# EAGLE design movimiento (EAGLE 8.7.1)
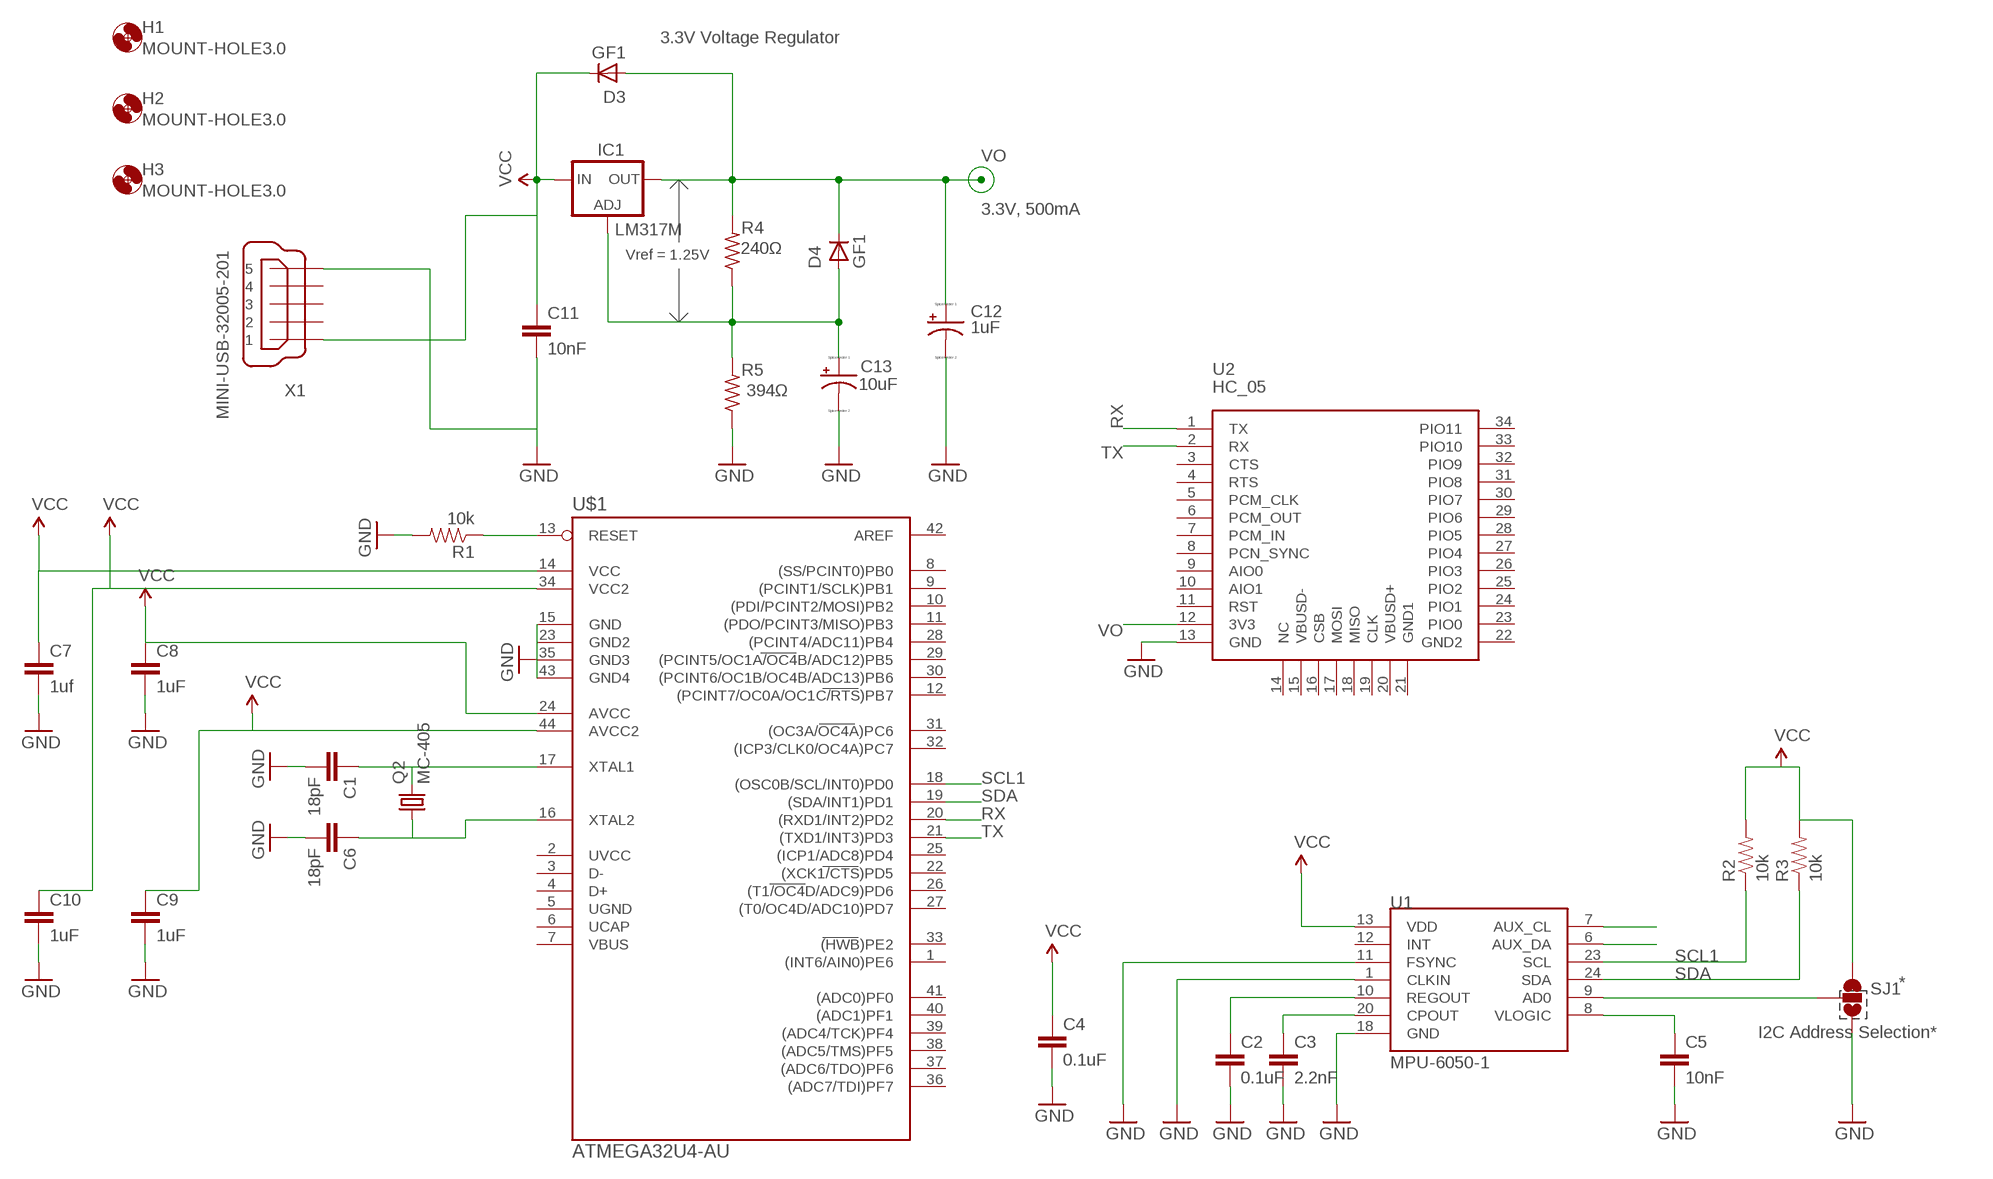
[diagram p0: schematic, sheet 1]

## Parts
C1  18pF  CAP0603-CAP  [0603-CAP]
C2  0.1uF  CAP0603-CAP  [0603-CAP]
C3  2.2nF  CAP0603-CAP  [0603-CAP]
C4  0.1uF  CAP0603-CAP  [0603-CAP]
C5  10nF  CAP0603-CAP  [0603-CAP]
C6  18pF  CAP0603-CAP  [0603-CAP]
C7  1uf  CAP0603-CAP  [0603-CAP]
C8  1uF  CAP0603-CAP  [0603-CAP]
C9  1uF  CAP0603-CAP  [0603-CAP]
C10  1uF  CAP0603-CAP  [0603-CAP]
C11  10nF  CAP0603-CAP  [0603-CAP]
C12  1uF  CPOL-US085CS-1AR  [085CS_1AR]
C13  10uF  CPOL-US085CS-1AR  [085CS_1AR]
D3  GF1  [SMA-DO214AC]
D4  GF1  [SMA-DO214AC]
H1  MOUNT-HOLE3.0  [3,0]
H2  MOUNT-HOLE3.0  [3,0]
H3  MOUNT-HOLE3.0  [3,0]
IC1  LM317MBSTT3  [SOT223]
Q2  MC-405  [MC-405]
R1  10k  RESISTOR0603-RES  [0603-RES]
R2  10k  RESISTOR0603-RES  [0603-RES]
R3  10k  RESISTOR0603-RES  [0603-RES]
R4  240Ω  R-US_M0805  [M0805]
R5  394Ω  R-US_M0805  [M0805]
SJ1  SOLDERJUMPER_2WAYPASTE2&3  [SJ_3_PASTE2&3]
U1  MPU-6050-1  [QFN-24-4MM2]
U2  HC_05  [BLUETOOTH_SMD]
U$1  ATMEGA32U4-AU  [TQFP44]
X1  MINI-USB-32005-201  [32005-201]

## Nets
ADO: SJ1.2 U1.9(AD0)
AUX_SCL: U1.7(AUX_CL)
AUX_SDA: U1.6(AUX_DA)
GND: C1.2 C2.2 C3.2 C4.2 C5.2 C6.2 C7.2 C8.2 C9.2 C10.2 C11.2 C12.- C13.- R1.2 R5.1 SJ1.3 U1.1(CLKIN) U1.11(FSYNC) U1.18(GND) U2.13(GND) X1.5
N$1: C1.1 Q2.2 U$1.17(XTAL1)
N$2: C6.1 Q2.1 U$1.16(XTAL2)
N$3: R1.1 U$1.13(RESET)
N$4: U$1.15(GND) U$1.23(GND2) U$1.35(GND3) U$1.43(GND4)
N$5: C3.1 U1.20(CPOUT)
N$6: C2.1 U1.10(REGOUT)
N$7: C13.+ D4.A IC1.1(ADJ) R4.1 R5.2
RX: U2.1(TX) U$1.20((RXD1/INT2)PD2)
SCL1: R2.1 U1.23(SCL) U$1.18((OSC0B/SCL/INT0)PD0)
SDA: R3.1 U1.24(SDA) U$1.19((SDA/INT1)PD1)
TX: U2.2(RX) U$1.21((TXD1/INT3)PD3)
VCC: C4.1 C7.1 C8.1 C9.1 C10.1 R2.2 R3.2 SJ1.1 U1.13(VDD) U$1.14(VCC) U$1.24(AVCC) U$1.34(VCC2) U$1.44(AVCC2)
VIN: C11.1 D3.K(C) IC1.3(IN) X1.1
VIO: C5.1 U1.8(VLOGIC)
VO: C12.+ D3.A D4.K(C) IC1.4(OUT) R4.2 U2.12(3V3)
Unconnected: U1.12(INT) U2.3(CTS) U2.4(RTS) U2.5(PCM_CLK) U2.6(PCM_OUT) U2.7(PCM_IN) U2.8(PCN_SYNC) U2.9(AIO0) U2.10(AIO1) U2.11(RST) U2.14(NC) U2.15(VBUSD-) U2.16(CSB) U2.17(MOSI) U2.18(MISO) U2.19(CLK) U2.20(VBUSD+) U2.21(GND1) U2.22(GND2) U2.23(PIO0) U2.24(PIO1) U2.25(PIO2) U2.26(PIO3) U2.27(PIO4) U2.28(PIO5) U2.29(PIO6) U2.30(PIO7) U2.31(PIO8) U2.32(PIO9) U2.33(PIO10) U2.34(PIO11) U$1.1((INT6/AIN0)PE6) U$1.2(UVCC) U$1.3(D-) U$1.4(D+) U$1.5(UGND) U$1.6(UCAP) U$1.7(VBUS) U$1.8((SS/PCINT0)PB0) U$1.9((PCINT1/SCLK)PB1) U$1.10((PDI/PCINT2/MOSI)PB2) U$1.11((PDO/PCINT3/MISO)PB3) U$1.12((PCINT7/OC0A/OC1C/RTS)PB7) U$1.22((XCK1/CTS)PD5) U$1.25((ICP1/ADC8)PD4) U$1.26((T1/OC4D/ADC9)PD6) U$1.27((T0/OC4D/ADC10)PD7) U$1.28((PCINT4/ADC11)PB4) U$1.29((PCINT5/OC1A/OC4B/ADC12)PB5) U$1.30((PCINT6/OC1B/OC4B/ADC13)PB6) U$1.31((OC3A/OC4A)PC6) U$1.32((ICP3/CLK0/OC4A)PC7) U$1.33((HWB)PE2) U$1.36((ADC7/TDI)PF7) U$1.37((ADC6/TDO)PF6) U$1.38((ADC5/TMS)PF5) U$1.39((ADC4/TCK)PF4) U$1.40((ADC1)PF1) U$1.41((ADC0)PF0) U$1.42(AREF) X1.2 X1.3 X1.4

## Notes on the sheet
- 3.3V Voltage Regulator
- 3.3V, 500mA
- Vref = 1.25V
- *
- I2C Address Selection*

## Library data of the parts
C1-C11 = SparkFun:CAP: Capacitor Standard 0603 ceramic capacitor, and 0.1" leaded capacitor.
C12 C13 = resistor:CPOL-US: POLARIZED CAPACITOR, American symbol
D3 D4 = diode:GF1: DIODE
H1-H3 = holes:MOUNT-HOLE: MOUNTING HOLE with drill center marker
IC1 = v-reg:LM317?*: 500 mA Adjustable Output Positive Voltage Regulator Source: http://www.onsemi.co.jp .. LM317M-D.PDF; PARTNUMBER: LM317M
Q2 = crystal:MC-405: kHz RANGE CRYSTAL UNIT SMD Source: MC-306_405_406_E07X.PDF Homepage <http://www.epsontoyocom.co.jp>; OC_FARNELL: unknown; OC_NEWARK: unknown
R1-R3 = SparkFun:RESISTOR: Resistor Basic schematic elements and footprints for 0603, 1206, and PTH resistors.
R4 R5 = resistor:R-US_: RESISTOR, American symbol
SJ1 = SparkFun:SOLDERJUMPER_2WAY: Solder Jumper 2 way solder jumper
U1 = Testing:MPU-6050
U2 = Modulo Bloutooth:HC_05: HC-05 Bluetooth Module
U$1 = mega32U4:ATMEGA32U4-AU
X1 = con-cypressindustries:MINI-USB-: MINI USB-B Conector Source: www.cypressindustries.com; OC_FARNELL: unknown; OC_NEWARK: unknown

## Board
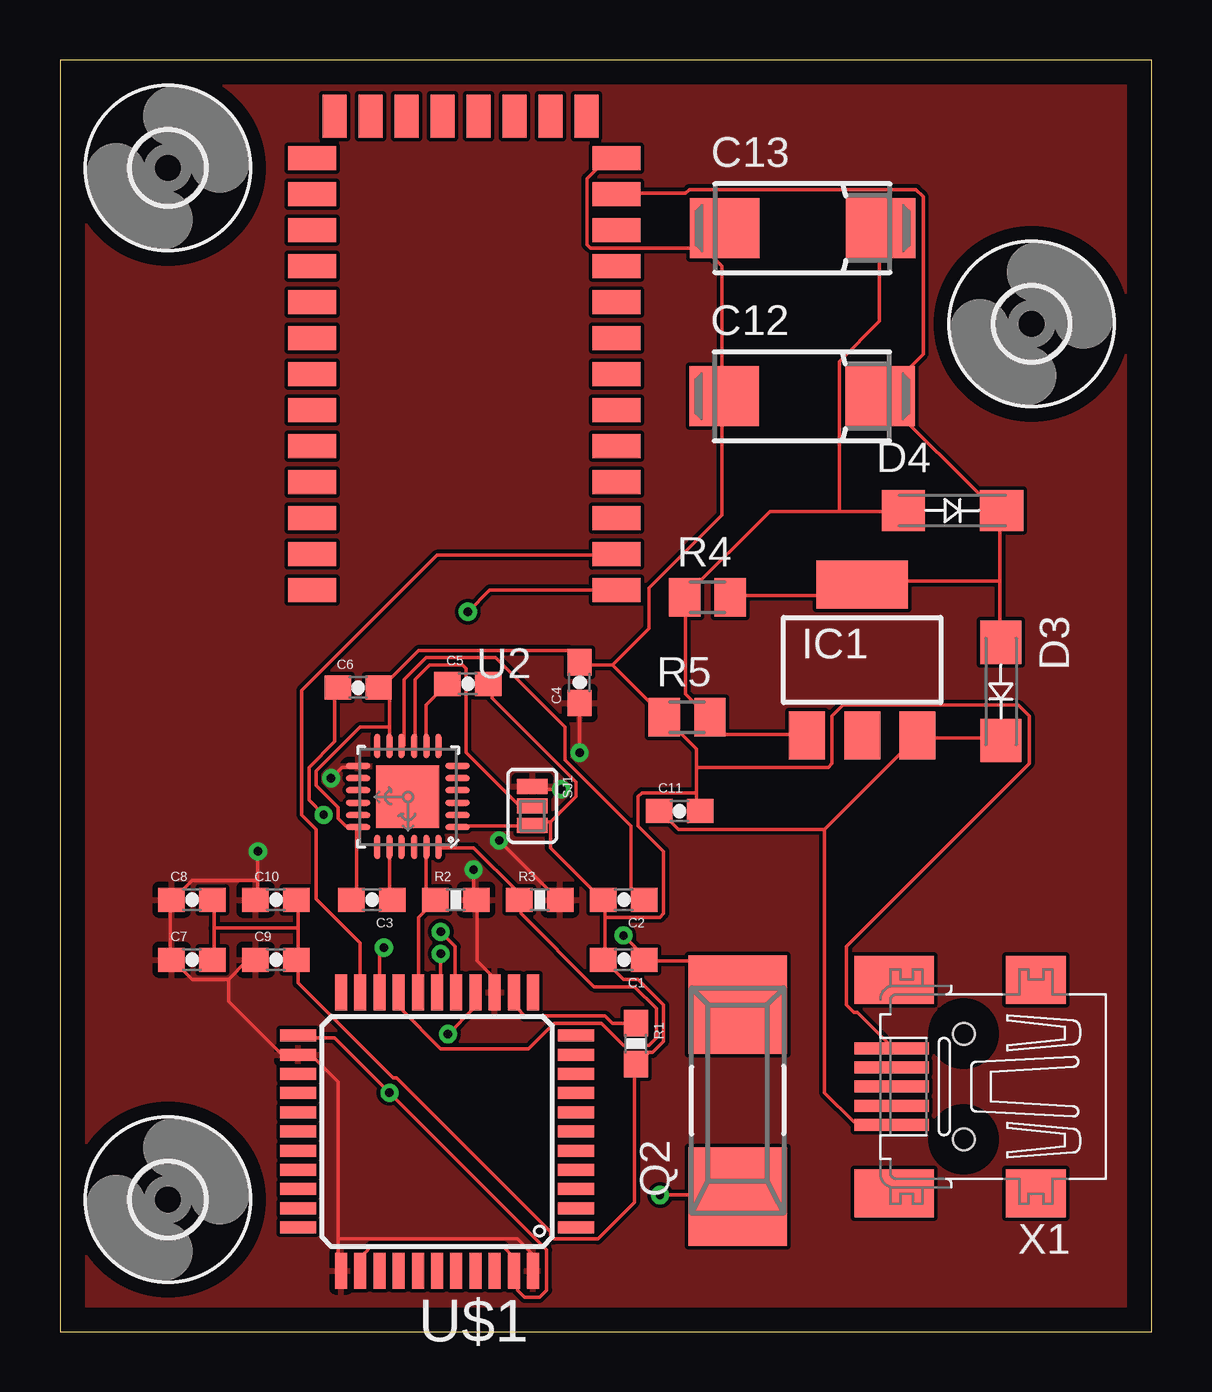
[diagram p1: board, top side]
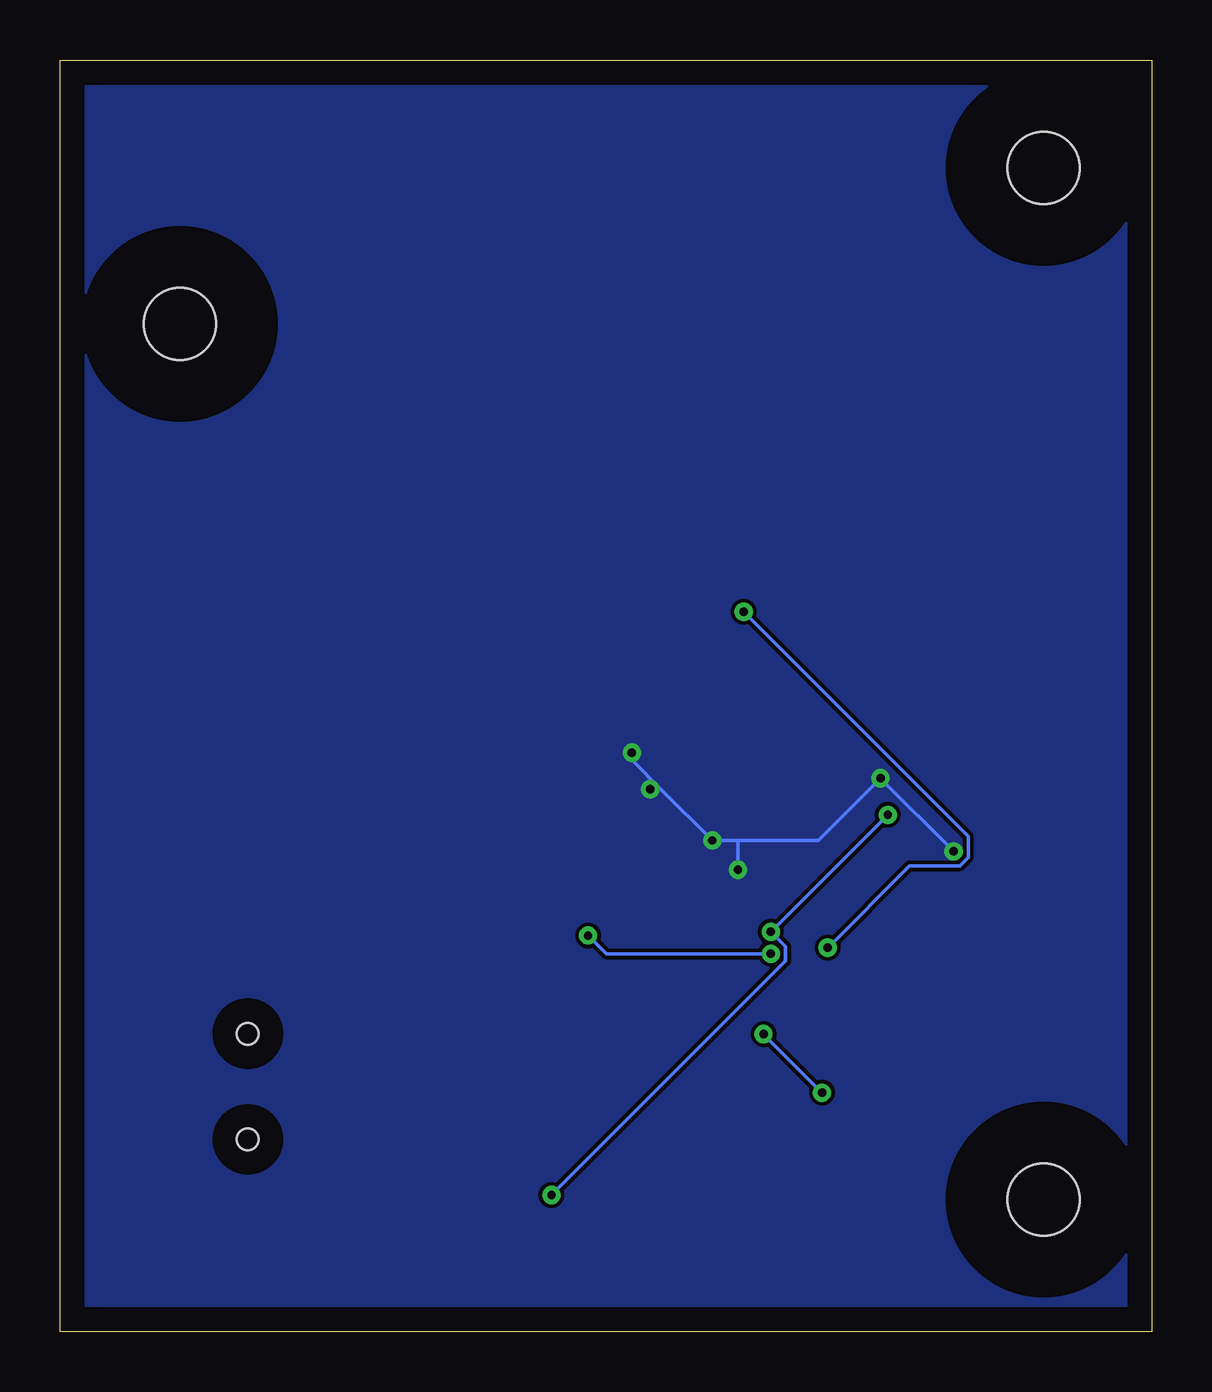
[diagram p2: board, bottom side, seen from below]

Size 45.5 x 53 mm. Coordinates in mm from the lower left corner, seen from the top.
Outline: 0,0 45.5,0 45.5,53 0,53 0,0
Copper layers (1*16): Top 0.035mm / dielectric 1.5mm / Bottom 0.035mm
Design rules "default": minimum track width 6mil, minimum drill 0.35mm, track to track 6mil, track to pad 6mil, pad to pad 6mil, via to via 6mil, smd to smd 6mil, copper to edge 40mil, drill to drill 6mil, minimum pad ring 10mil, minimum via ring 8mil, stop-mask expansion 4mil, vias tented up to drill 0mil, thermal gap 10mil

### Footprints (pad centres in the part's own frame; a part is rotated, then mirrored left to right if it is on the bottom)
0603-CAP = smd 1.1 x 1: 1 -0.85,0; 2 0.85,0
085CS_1AR = smd 2.9 x 2.5: + 3.25,0; - -3.25,0
SMA-DO214AC = smd 1.8 x 1.7: A -2.05,0; K 2.05,0
3,0 = hole 3: 0,0
SOT223 = smd 1.5 x 2: 1 -2.3,-3.15; 2 0,-3.15; 3 2.3,-3.15 | smd 3.8 x 2: 4 0,3.15
MC-405 = smd 4.1 x 4.1: 1 -4,0; 2 4,0
0603-RES = smd 1.1 x 1: 1 -0.85,0; 2 0.85,0
M0805 = smd 1.3 x 1.6: 1 -0.95,0; 2 0.95,0
SJ_3_PASTE2&3 = smd 0.635 x 1.27: 1 -0.813,0; 2 0,0; 3 0.813,0
QFN-24-4MM2 = smd 1.016 x 0.254: 1 -2.066,1.257; 2 -2.066,0.75; 3 -2.066,0.247; 4 -2.066,-0.287; 5 -2.066,-0.792; 6 -2.066,-1.297; 13 2.086,-1.297; 14 2.086,-0.792; 15 2.086,-0.287; 16 2.086,0.247; 17 2.086,0.75; 18 2.086,1.257 | smd 0.254 x 1.016: 7 -1.267,-2.122; 8 -0.762,-2.122; 9 -0.258,-2.122; 10 0.278,-2.122; 11 0.78,-2.122; 12 1.287,-2.122; 19 1.287,2.082; 20 0.78,2.082; 21 0.278,2.082; 22 -0.258,2.082; 23 -0.762,2.082; 24 -1.267,2.082 | smd 2.616 x 2.616: P$1 0.02,-0.01
BLUETOOTH_SMD = smd 2 x 1: 1 -6.38,5.08; 2 -6.38,3.58; 3 -6.38,2.08; 4 -6.38,0.58; 5 -6.38,-0.92; 6 -6.38,-2.42; 7 -6.38,-3.92; 8 -6.38,-5.42; 9 -6.38,-6.92; 10 -6.38,-8.42; 11 -6.38,-9.92; 12 -6.38,-11.42; 13 -6.38,-12.92; 22 6.32,-12.92; 23 6.32,-11.42; 24 6.32,-9.92; 25 6.32,-8.42; 26 6.32,-6.92; 27 6.32,-5.42; 28 6.32,-3.92; 29 6.32,-2.42; 30 6.32,-0.92; 31 6.32,0.58; 32 6.32,2.08; 33 6.32,3.58; 34 6.32,5.08 | smd 1 x 1.8: 14 -5.13,-14.67; 15 -3.63,-14.67; 16 -2.13,-14.67; 17 -0.63,-14.67; 18 0.87,-14.67; 19 2.37,-14.67; 20 3.87,-14.67; 21 5.37,-14.67
TQFP44 = smd 1.5 x 0.5: 1 -5.8,4; 2 -5.8,3.2; 3 -5.8,2.4; 4 -5.8,1.6; 5 -5.8,0.8; 6 -5.8,0; 7 -5.8,-0.8; 8 -5.8,-1.6; 9 -5.8,-2.4; 10 -5.8,-3.2; 11 -5.8,-4; 23 5.8,-4; 24 5.8,-3.2; 25 5.8,-2.4; 26 5.8,-1.6; 27 5.8,-0.8; 28 5.8,0; 29 5.8,0.8; 30 5.8,1.6; 31 5.8,2.4; 32 5.8,3.2; 33 5.8,4 | smd 0.5 x 1.5: 12 -4,-5.8; 13 -3.2,-5.8; 14 -2.4,-5.8; 15 -1.6,-5.8; 16 -0.8,-5.8; 17 0,-5.8; 18 0.8,-5.8; 19 1.6,-5.8; 20 2.4,-5.8; 21 3.2,-5.8; 22 4,-5.8; 34 4,5.8; 35 3.2,5.8; 36 2.4,5.8; 37 1.6,5.8; 38 0.8,5.8; 39 0,5.8; 40 -0.8,5.8; 41 -1.6,5.8; 42 -2.4,5.8; 43 -3.2,5.8; 44 -4,5.8
32005-201 = smd 3.1 x 0.5: 1 3,1.6; 2 3,0.8; 3 3,0; 4 3,-0.8; 5 3,-1.6 | smd 2.5 x 2: M1 -3,-4.45; M2 -3,4.45 | smd 3.3 x 2: M3 2.9,4.45; M4 2.9,-4.45 | hole 0.9: 0,2.2; 0,-2.2

### Placement (x,y rotation side)
C1  23.5,15.5 180 top
C2  23.5,18 180 top
C3  13,18 180 top
C4  21.66,27.05 90 top
C5  17,27 0 top
C6  12.43,26.84 0 top
C7  5.5,15.5 0 top
C8  5.5,18 0 top
C9  9,15.5 0 top
C10  9,18 0 top
C11  25.83,21.69 0 top
C12  30.93,38.98 0 top
C13  30.95,45.99 0 top
D3  39.22,26.68 270 top
D4  37.2,34.22 0 top
H1  4.5,5.5 0 top
H2  40.5,42 0 top
H3  4.5,48.5 0 top
IC1  33.44,27.99 0 top
Q2  28.25,9.63 90 top
R1  24,12 270 top
R2  16.5,18 0 top
R3  20,18 0 top
R4  26.99,30.61 0 top
R5  26.14,25.61 0 top
SJ1  19.69,21.91 270 top
U1  14.51,22.28 180 top
U2  16.82,35.99 180 top
U$1  15.72,8.34 180 top
X1  37.67,10.21 180 top

### Tracks (layer width: path | path; a pad name or v marks a point on that pad's centre or on a via)
ADO
  Top 0.152: U1.9 14.8,24.43 14.8,27.18 15.41,27.79 16.78,27.79 16.93,27.63 16.93,24.13 19.07,21.99 19.68,21.99 SJ1.2
GND
  Top 0.152: U1.1 16.63,21.08 19.68,21.08 SJ1.3 19.83,21.23 20.44,21.23 | 20.44,21.23 21.51,22.3 21.51,22.91 18,26.41 18,26.87 C5.2 | 6.42,16.81 6.42,17.88 C8.2 | 6.42,16.81 6.42,15.59 C7.2 | 9.93,16.81 9.93,17.88 C10.2 | 9.93,16.81 9.93,15.59 C9.2 9.93,15.44 9.93,14.53 13.89,10.56 14.04,10.56 20.44,4.16 20.44,4.01 20.59,3.86 22.42,3.86 23.95,5.38 23.95,11.02 R1.2 24.1,11.17 24.55,11.63 24.71,11.63 25.16,12.09 25.16,13.61 24.1,14.68 23.49,14.68 22.73,15.44 C1.2 22.73,15.59 22.73,17.27 | 9.93,16.81 6.42,16.81 | 22.73,17.27 22.73,17.88 C2.2 22.57,18.03 20.44,20.17 20.44,21.23 | 26.84,45.16 22.12,45.16 21.96,45.31 21.96,48.06 22.73,48.82 23.18,48.82 U2.13 | 26.84,45.16 27.6,45.92 C13.- 26.84,45.16 | 26.84,45.16 27.6,44.4 27.6,39.06 C12.- 27.6,38.91 27.6,34.03 24.55,30.99 24.55,29.31 23.03,27.79 | 13.73,25.19 13.73,26.41 13.43,26.72 C6.2 13.43,26.87 14.95,28.39 21.2,28.39 21.66,27.94 C4.2 21.81,27.79 23.03,27.79 | 13.73,25.19 13.73,24.43 U1.11 | C3.2 12.21,18.03 12.36,18.18 12.36,20.93 U1.18 12.36,21.08 11.91,21.08 11.6,21.38 11.6,21.84 10.69,22.76 10.69,23.37 12.52,25.19 13.73,25.19 | 26.54,23.52 26.54,24.28 25.32,25.5 R5.1 25.16,25.65 23.03,27.79 | 26.54,23.52 26.54,22.45 | 26.54,22.45 26.54,21.84 C11.2 | 26.54,23.52 32.02,23.52 32.17,23.67 32.17,25.65 32.63,26.11 39.95,26.11 40.41,25.65 40.41,23.67 32.78,16.05 32.78,13.61 33.09,13.31 33.24,13.31 34.61,11.94 X1.5 | 22.73,17.27 25.01,17.27 25.16,17.42 25.16,20.01 24.1,21.08 24.1,22.3 24.25,22.45 26.54,22.45
N$1  (via drill 0.35)
  Top 0.152: Q2.2 28.21,13.77 26.54,15.44 24.4,15.44 C1.1 24.4,15.59 v23.49,16.51 | v15.87,15.75 15.87,14.22 U$1.17
  Bottom 0.152: v15.87,15.75 22.73,15.75 v23.49,16.51
N$2  (via drill 0.35)
  Top 0.152: v10.99,21.54 10.38,22.15 10.38,23.52 11.45,24.58 11.45,26.72 C6.1 | v15.87,16.66 16.48,16.05 16.48,14.22 U$1.16 | v25.01,5.69 28.21,5.69 Q2.1
  Bottom 0.152: v10.99,21.54 v15.87,16.66 15.26,16.05 15.26,15.44 v25.01,5.69
N$3
  Top 0.152: R1.1 23.95,12.85 23.03,12.85 22.73,13.16 19.37,13.16 19.07,13.46 19.07,14.07 U$1.13
N$4  (via drill 0.35)
  Top 0.152: U$1.35 12.67,2.64 12.67,3.25 12.97,3.55 18.46,3.55 18.92,3.1 18.92,2.64 U$1.43 19.07,2.49 19.07,1.73 19.37,1.42 19.98,1.42 20.29,1.73 20.29,3.4 v13.73,9.95 11.45,12.24 9.93,12.24 U$1.23 | v16.17,12.39 17.24,13.46 17.24,14.07 U$1.15
  Bottom 0.152: v13.73,9.95 v16.17,12.39
N$5
  Top 0.152: U1.20 13.73,20.17 13.73,18.03 C3.1
N$6
  Top 0.152: U1.10 14.34,24.43 14.34,27.18 15.26,28.09 18.15,28.09 21.05,25.19 21.05,23.82 23.79,21.08 23.79,18.49 24.25,18.03 C2.1
N$7
  Top 0.152: 32.48,34.19 29.58,34.19 26.08,30.68 R4.1 26.08,30.53 26.08,26.57 26.99,25.65 R5.2 27.15,25.5 27.76,24.89 31.11,24.89 IC1.1 | 32.48,34.19 35.07,34.19 D4.A | 32.48,34.19 32.48,40.44 34.16,42.11 34.16,45.92 C13.+
RX  (via drill 0.35)
  Top 0.152: U$1.20 13.32,15.82 v13.5,16 | U2.1 17.91,30.91 v17,30
  Bottom 0.152: v13.5,16 10.09,19.41 8,19.41 7.64,19.76 7.64,20.64 v17,30
SCL1
  Top 0.152: U1.23 15.26,20.17 15.26,18.34 15.56,18.03 R2.1 15.56,17.88 14.95,17.27 14.95,14.22 U$1.18
SDA
  Top 0.152: U1.24 15.87,20.17 17.24,20.17 19.07,18.34 19.07,18.03 R3.1 19.22,17.88 19.22,17.42 22.27,14.37 23.95,14.37 24.86,13.46 24.86,12.24 24.55,11.94 23.49,11.94 22.57,12.85 20.59,12.85 19.53,11.78 15.87,11.78 14.19,13.46 14.19,14.07 U$1.19
TX
  Top 0.152: U$1.21 12.52,14.22 12.52,16.2 10.69,18.03 10.69,20.93 10.08,21.54 10.08,26.72 15.72,32.36 23.18,32.36 U2.2
VCC  (via drill 0.35)
  Top 0.152: U$1.14 18,14.22 18,14.83 17.39,15.44 17.39,17.88 R2.2 17.24,18.03 v17.24,19.25 | v11.3,23.06 11.75,23.52 12.36,23.52 U1.13 | 8.25,18.79 8.25,18.03 C10.1 | 8.25,18.79 v8.25,20.01 | v18.31,20.47 20.75,18.03 R3.2 | v21.66,24.13 21.66,26.11 C4.1 | v20.9,22.6 19.83,22.6 SJ1.1 | 7.03,14.68 7.79,15.44 8.1,15.44 C9.1 | 7.03,14.68 5.5,14.68 4.74,15.44 C7.1 4.59,15.59 4.59,17.88 C8.1 4.74,18.03 5.5,18.79 8.25,18.79 | 7.03,14.68 7.03,13.77 9.16,11.63 9.77,11.63 U$1.24 9.93,11.48 10.53,11.48 11.6,10.41 11.6,3.86 | 11.6,3.86 11.6,2.64 U$1.34 | 11.6,3.86 19.07,3.86 19.68,3.25 19.68,2.64 U$1.44
  Bottom 0.152: v8.25,20.01 v11.3,23.06 13.89,20.47 17.24,20.47 | 17.24,20.47 v18.31,20.47 20.44,22.6 | v21.66,24.13 21.66,23.82 20.44,22.6 | 20.44,22.6 v20.9,22.6 | 17.24,20.47 v17.24,19.25
  pour Bottom: 0,53 45.5,53 45.5,0 0,0
  pour Top: 0,53 45.5,53 45.5,0 0,0
VIN
  Top 0.152: 31.87,20.93 25.77,20.93 25.01,21.69 C11.1 | 31.87,20.93 35.68,24.74 IC1.3 35.83,24.74 39.19,24.74 D3.K | 31.87,20.93 31.87,9.95 33.09,8.74 34.61,8.74 X1.1
VIO
  Top 0.152: U1.8 15.26,24.43 15.26,26.11 16.02,26.87 C5.1
VO
  Top 0.152: 39.19,31.29 39.19,34.19 D4.K 39.19,34.34 38.88,34.34 34.31,38.91 C12.+ 34.31,39.06 35.98,40.74 35.98,47.29 35.68,47.6 26.23,47.6 26.08,47.44 23.34,47.44 U2.12 | 39.19,31.29 39.19,28.85 D3.A | R4.2 28.06,30.68 32.94,30.68 33.39,31.14 IC1.4 33.55,31.29 39.19,31.29